# EAGLE design ESP32-S3 Round SPI TFT with Touch 1.28“ GC9A01 v1.1 (EAGLE 6.1)
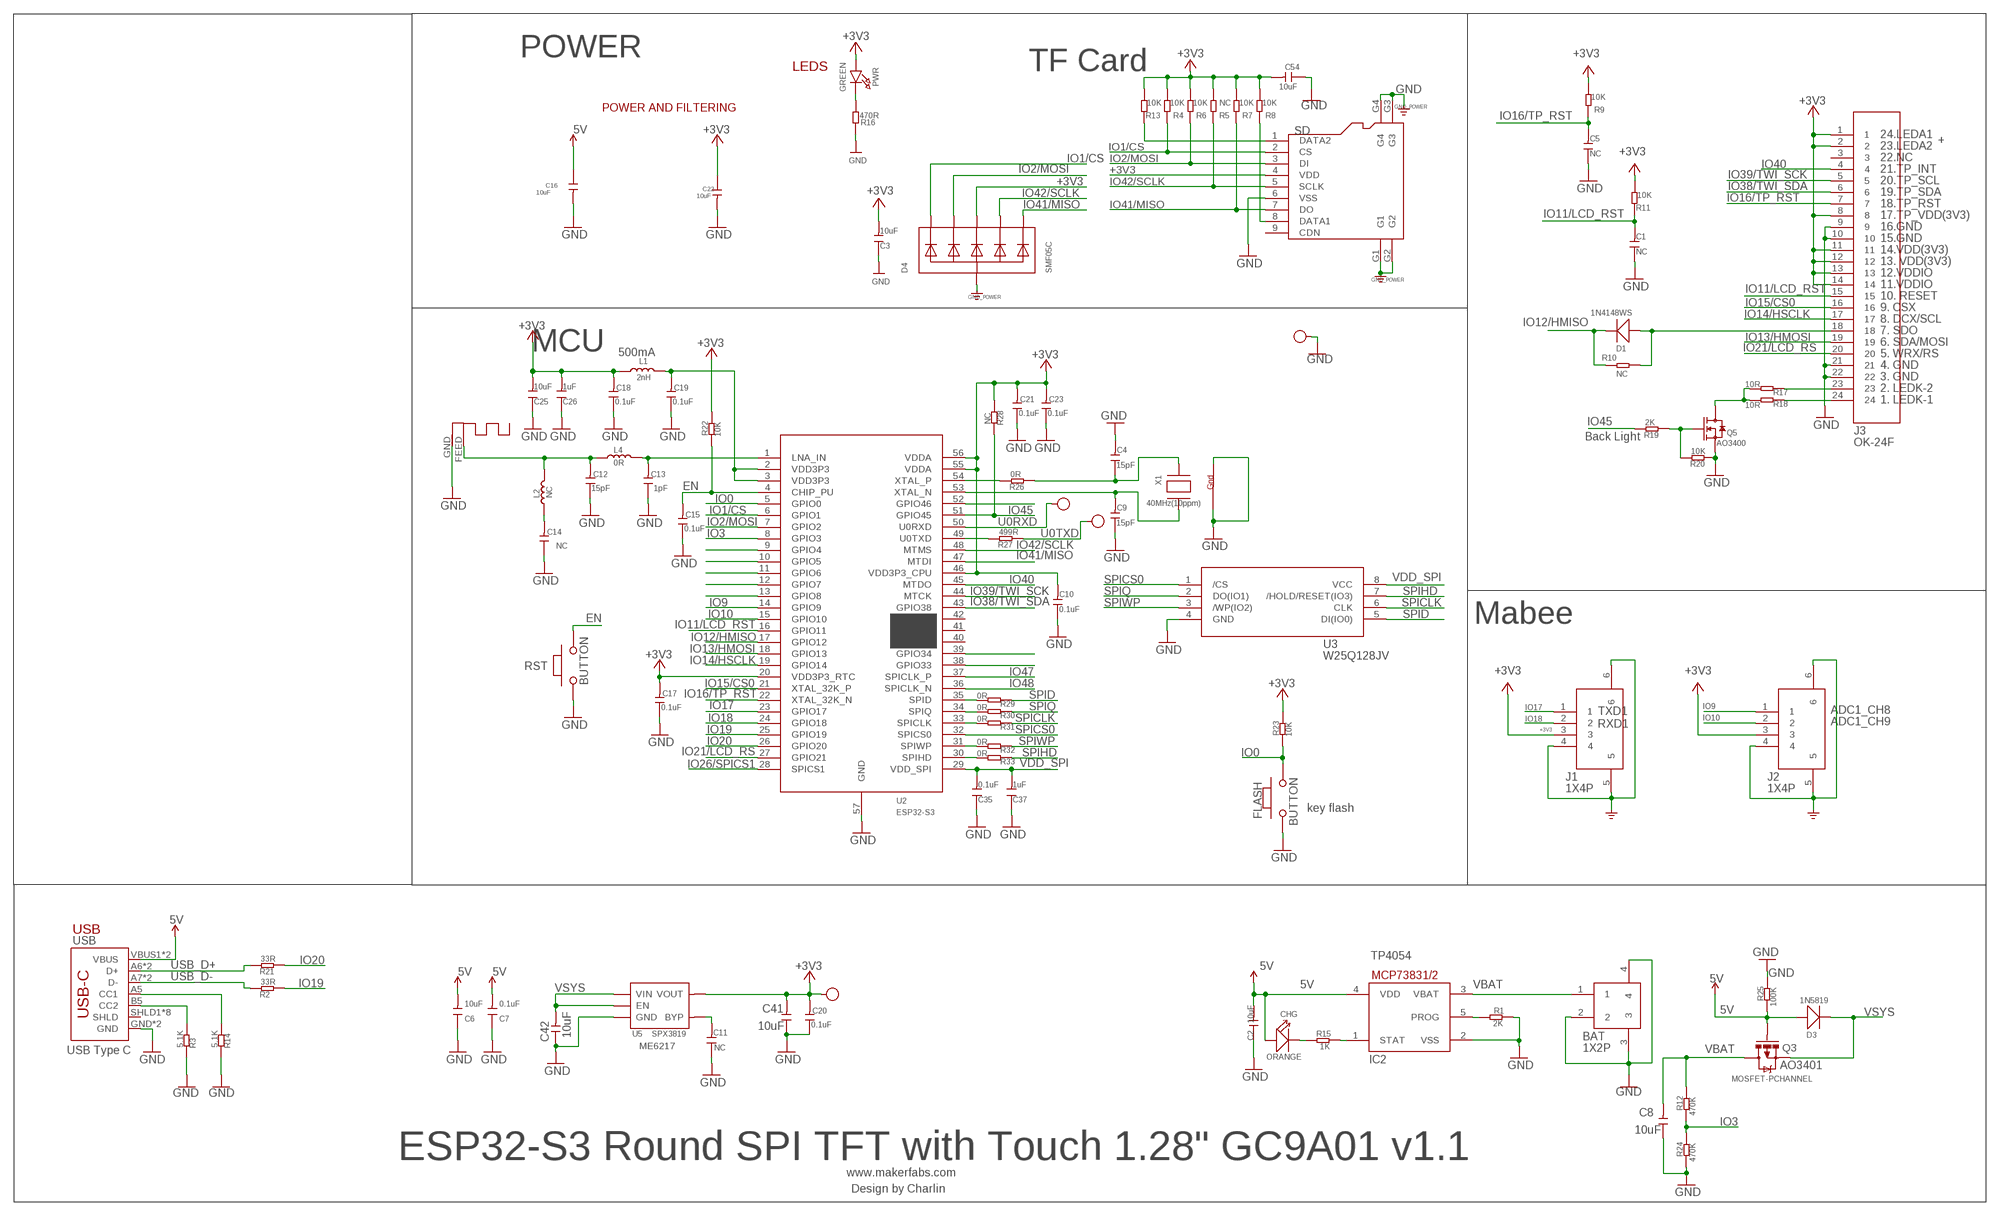
[diagram p0: schematic, sheet 1]

## Parts
3V3  TEST-POINT'4545'  [TP-D45MIL]
ANT1  ANTENNA  [RN-ANT]
BAT  1X2P  [1X2P-SMT1.25MM]
C1  NC  DISCRETE_C-0402  [DISCRETE_C0402]
C2  10uF  C-0603  [C0603]
C3  10uF  DISCRETE_C-0603  [DISCRETE_C0603]
C4  15pF  DISCRETE_C-0402  [DISCRETE_C0402]
C5  NC  DISCRETE_C-0402  [DISCRETE_C0402]
C6  10uF  DISCRETE_C-0603  [DISCRETE_C0603]
C7  0.1uF  DISCRETE_C-0603  [DISCRETE_C0603]
C8  10uF  C-0603  [C0603]
C9  15pF  DISCRETE_C-0402  [DISCRETE_C0402]
C10  0.1uF  DISCRETE_C-0402  [DISCRETE_C0402]
C11  NC  DISCRETE_C-0402  [DISCRETE_C0402]
C12  15pF  DISCRETE_C-0402  [DISCRETE_C0402]
C13  1pF  DISCRETE_C-0402  [DISCRETE_C0402]
C14  NC  DISCRETE_C-0402  [DISCRETE_C0402]
C15  0.1uF  DISCRETE_C-0402  [DISCRETE_C0402]
C16  10uF  C-0603  [C0603]
C17  0.1uF  DISCRETE_C-0402  [DISCRETE_C0402]
C18  0.1uF  DISCRETE_C-0402  [DISCRETE_C0402]
C19  0.1uF  DISCRETE_C-0402  [DISCRETE_C0402]
C20  0.1uF  DISCRETE_C-0402  [DISCRETE_C0402]
C21  0.1uF  DISCRETE_C-0402  [DISCRETE_C0402]
C22  10uF  C-0603  [C0603]
C23  0.1uF  DISCRETE_C-0402  [DISCRETE_C0402]
C25  10uF  DISCRETE_C-0603  [DISCRETE_C0603]
C26  1uF  DISCRETE_C-0603  [DISCRETE_C0603]
C35  0.1uF  DISCRETE_C-0603  [DISCRETE_C0603]
C37  1uF  DISCRETE_C-0603  [DISCRETE_C0603]
C41  10uF  C-0603  [C0603]
C42  10uF  C-0603  [C0603]
C54  10uF  DISCRETE_C-0603  [DISCRETE_C0603]
CHG  ORANGE  007-LED0603  [D0603]
D1  1N4148WS  D'0805'  [SOD323]
D3  1N5819  D'0805'  [SOD323]
D4  SMF05C  TVSARRAY_5LANE  [SOT363]
FLASH  BUTTON  PB157  [157SW]
GND  TEST-POINT'4545'  [TP-D45MIL]
IC2  MCP73831/OT  [SOT23-5L]
J1  1X4P  [1X4P-SMT1.25MM]
J2  1X4P  [1X4P-SMT1.25MM]
J3  OK-24F  [OK-24F-0.4]
L1  2nH  DISCRETE_L0603  [DISCRETE_L0603]
L2  NC  DISCRETE_L0402  [DISCRETE_L0402]
L4  0R  DISCRETE_L0402  [DISCRETE_L0402]
PWR  GREEN  LED0805_NOOUTLINE  [CHIPLED_0805_NOOUTLINE]
Q3  MOSFET-PCHANNEL  [SOT23-3]
Q5  AO3400  MOSFET-N'SOT23'  [SOT23@1]
R1  2K  DISCRETE_R-0402  [DISCRETE_R0402]
R2  33R  DISCRETE_R-0402  [DISCRETE_R0402]
R3  5.1K  DISCRETE_R-0402  [DISCRETE_R0402]
R4  10K  DISCRETE_R-0402  [DISCRETE_R0402]
R5  NC  DISCRETE_R-0402  [DISCRETE_R0402]
R6  10K  DISCRETE_R-0402  [DISCRETE_R0402]
R7  10K  DISCRETE_R-0402  [DISCRETE_R0402]
R8  10K  DISCRETE_R-0402  [DISCRETE_R0402]
R9  10K  DISCRETE_R-0402  [DISCRETE_R0402]
R10  NC  R-0603  [R0603]
R11  10K  DISCRETE_R-0402  [DISCRETE_R0402]
R12  470K  DISCRETE_R-0402  [DISCRETE_R0402]
R13  10K  DISCRETE_R-0402  [DISCRETE_R0402]
R14  5.1K  DISCRETE_R-0402  [DISCRETE_R0402]
R15  1K  DISCRETE_R-0402  [DISCRETE_R0402]
R16  470R  DISCRETE_R-0402  [DISCRETE_R0402]
R17  10R  DISCRETE_R-0402  [DISCRETE_R0402]
R18  10R  DISCRETE_R-0402  [DISCRETE_R0402]
R19  2K  DISCRETE_R-0402  [DISCRETE_R0402]
R20  10K  DISCRETE_R-0402  [DISCRETE_R0402]
R21  33R  DISCRETE_R-0402  [DISCRETE_R0402]
R22  10K  DISCRETE_R-0402  [DISCRETE_R0402]
R23  10K  DISCRETE_R-0402  [DISCRETE_R0402]
R24  470K  DISCRETE_R-0402  [DISCRETE_R0402]
R25  100K  DISCRETE_R-0402  [DISCRETE_R0402]
R26  0R  DISCRETE_R-0402  [DISCRETE_R0402]
R27  499R  DISCRETE_R-0402  [DISCRETE_R0402]
R28  NC  DISCRETE_R-0402  [DISCRETE_R0402]
R29  0R  DISCRETE_R-0402  [DISCRETE_R0402]
R30  0R  DISCRETE_R-0402  [DISCRETE_R0402]
R31  0R  DISCRETE_R-0402  [DISCRETE_R0402]
R32  0R  DISCRETE_R-0402  [DISCRETE_R0402]
R33  0R  DISCRETE_R-0402  [DISCRETE_R0402]
RST  BUTTON  PB157  [157SW]
RX  TEST-POINT'4545'  [TP-D45MIL]
SD  HOLDER-MICROSD-9P  [9P-SMD-W/-RING]
TX  TEST-POINT'4545'  [TP-D45MIL]
U2  ESP32-S3  [QFN56-7*7MM]
U3  W25Q128JV  [SOIC-8-208MIL]
U5  SPX3819  [SOT23-5]
USB  USB_C5  [USB-C-16P-5]
X1  40MHz(10ppm)  XTAL-4-3225  [NX3225]

## Nets
5V: C2.2 C6.2 C7.2 C16.1 CHG.+ D3.+ IC2.4(VDD) Q3.1(G) R25.1 USB.VBUS1(VBUS) USB.VBUS2(VBUS)
+3V3: 3V3.T C3.2 C10.2 C17.2 C18.2 C20.2 C21.2 C22.1 C23.2 C25.2 C26.2 C41.2 C54.2 D4.4(C3) J1.3 J2.3 J3.1 J3.2 J3.8 J3.11 J3.12 J3.13 J3.14 L1.1 PWR.A R4.2 R5.2 R6.2 R7.2 R8.2 R9.2 R11.2 R13.2 R22.2 R23.2 R28.1 SD.4(VDD) U2.20(VDD3P3_RTC) U2.46(VDD3P3_CPU) U2.55(VDDA) U2.56(VDDA) U5.5(VOUT)
EN: C15.2 R22.1 RST.2 U2.4(CHIP_PU)
GND: ANT1.GND BAT.2 BAT.3 BAT.4 C1.1 C2.1 C3.1 C4.2 C5.1 C6.1 C7.1 C8.1 C9.1 C10.1 C11.1 C12.1 C13.1 C14.1 C15.1 C16.2 C17.1 C18.1 C19.1 C20.1 C21.1 C22.2 C23.1 C25.1 C26.1 C35.1 C37.1 C41.1 C42.1 C54.1 D4.2(A) FLASH.1 GND.T IC2.2(VSS) J1.4 J1.5 J1.6 J2.4 J2.5 J2.6 J3.9 J3.10 J3.21 J3.22 Q5.2(S) R1.2 R3.2 R14.2 R16.1 R20.1 R24.1 R25.2 RST.1 SD.6(VSS) SD.G1 SD.G2 SD.G3 SD.G4 U2.57(GND) U3.4(GND) U5.2(GND) USB.GND USB.GND2(GND) X1.2(G2) X1.4(G1) ; supply symbol labelled GND_POWER
IO0: FLASH.2 R23.1 U2.5(GPIO0)
IO1/CS: D4.1(C1) R4.1 SD.2(CS) U2.6(GPIO1)
IO2/MOSI: D4.3(C2) R6.1 SD.3(DI) U2.7(GPIO2)
IO3: R12.1 R24.2 U2.8(GPIO3)
IO9: J2.1 U2.14(GPIO9)
IO10: J2.2 U2.15(GPIO10)
IO11/LCD_RST: C1.2 J3.15 R11.1 U2.16(GPIO11)
IO12/HMISO: D1.- R10.1 U2.17(GPIO12)
IO13/HMOSI: J3.19 U2.18(GPIO13)
IO14/HSCLK: J3.17 U2.19(GPIO14)
IO15/CS0: J3.16 U2.21(XTAL_32K_P)
IO16/TP_RST: C5.2 J3.7 R9.1 U2.22(XTAL_32K_N)
IO17: J1.1 U2.23(GPIO17)
IO18: J1.2 U2.24(GPIO18)
IO19: R2.1 U2.25(GPIO19)
IO20: R21.1 U2.26(GPIO20)
IO21/LCD_RS: J3.20 U2.27(GPIO21)
IO26/SPICS1: U2.28(SPICS1)
IO38/TWI_SDA: J3.6 U2.43(GPIO38)
IO39/TWI_SCK: J3.5 U2.44(MTCK)
IO40: J3.4 U2.45(MTDO)
IO41/MISO: D4.6(C5) R7.1 SD.7(DO) U2.47(MTDI)
IO42/SCLK: D4.5(C4) R5.1 SD.5(SCLK) U2.48(MTMS)
IO45: R19.2 R28.2 U2.51(GPIO45)
IO47: U2.37(SPICLK_P)
IO48: U2.36(SPICLK_N)
N$1: D1.+ J3.18 R10.2
N$2: IC2.5(PROG) R1.1
N$6: R14.1 USB.A5(CC1)
N$7: PWR.C R16.2
N$14: R3.1 USB.B5(CC2)
N$20: Q5.1(G) R19.1 R20.2
N$21: J3.23 R17.1
N$22: Q5.3(D) R17.2 R18.2
N$25: CHG.- R15.1
N$26: IC2.1(STAT) R15.2
N$30: ANT1.FEED C12.2 L2.2 L4.1
N$31: C13.2 L4.2 U2.1(LNA_IN)
N$32: R29.2 U2.35(SPID)
N$33: C19.2 L1.2 U2.2(VDD3P3) U2.3(VDD3P3)
N$34: C14.2 L2.1
N$35: R30.2 U2.34(SPIQ)
N$37: R26.2 U2.54(XTAL_P)
N$38: R31.2 U2.33(SPICLK)
N$40: R32.2 U2.31(SPIWP)
N$41: R33.2 U2.30(SPIHD)
N$45: U2.9(GPIO4)
N$46: U2.10(GPIO5)
N$47: R13.1 SD.1(DATA2)
N$48: R8.1 SD.8(DATA1)
N$49: U2.11(GPIO6)
N$50: U2.12(GPIO7)
N$51: U2.13(GPIO8)
N$63: R27.2 U2.49(U0TXD)
N$64: U2.52(GPIO46)
N$65: C9.2 U2.53(XTAL_N) X1.3(X2)
N$66: C4.1 R26.1 X1.1(X1)
N$67: J3.24 R18.1
N$73: U2.39(GPIO34)
N$74: U2.38(GPIO33)
N$76: C11.2 U5.4(BYP)
SPICLK: R31.1 U3.6(CLK)
SPICS0: U2.32(SPICS0) U3.1(/CS)
SPID: R29.1 U3.5(DI(IO0))
SPIHD: R33.1 U3.7(/HOLD/RESET(IO3))
SPIQ: R30.1 U3.2(DO(IO1))
SPIWP: R32.1 U3.3(/WP(IO2))
U0RXD: RX.T U2.50(U0RXD)
U0TXD: R27.1 TX.T
USB_D+: R21.2 USB.A6(D+) USB.B6(D+)
USB_D-: R2.2 USB.A7(D-) USB.B7(D-)
VBAT: BAT.1 C8.2 IC2.3(VBAT) Q3.3(D) R12.2
VDD_SPI: C35.2 C37.2 U2.29(VDD_SPI) U3.8(VCC)
VSYS: C42.2 D3.- Q3.2(S) U5.1(VIN) U5.3(EN)
Unconnected: J3.3 SD.9(CDN) U2.40(GPIO35) U2.41(GPIO36) U2.42(GPIO37) USB.SHLD1(SHLD) USB.SHLD2(SHLD) USB.SHLD3(SHLD) USB.SHLD4(SHLD) USB.SHLD5(SHLD) USB.SHLD6(SHLD) USB.SHLD7(SHLD) USB.SHLD8(SHLD)

## Notes on the sheet
- POWER
- LEDS | TF Card
- POWER AND FILTERING
- 24.LEDA1
- +
- 23.LEDA2
- 22.NC
- 21.TP_INT
- 20.TP_SCL
- 19.TP_SDA
- 18.TP_RST
- 17.TP_VDD(3V3)
- 16.GND
- 15.GND
- 14.VDD(3V3)
- 13. VDD(3V3)
- 12.VDDIO
- 11.VDDIO
- 10. RESET
- 9. CSX
- 8. DCX/SCL
- 7. SDO
- 6. SDA/MOSI
- MCU
- 500mA | 5. WRX/RS
- 4. GND
- 3. GND
- 2. LEDK-2
- 1. LEDK-1
- Back Light
- Mabee
- TXD1 | ADC1_CH8
- RXD1 | ADC1_CH9
- key flash
- USB
- TP4054
- ME6217
- USB Type C
- AO3401
- ESP32-S3 Round SPI TFT with Touch 1.28" GC9A01 v1.1
- www.makerfabs.com
- Design by Charlin

## Library data of the parts
3V3 GND RX TX = Discrete-new:TEST-POINT; PARTNO: DNP
ANT1 = adafruit:ANTENNA
BAT = sale:1X2P
C1 C3-C7 C9-C15 C17-C21 C23 C25 C26 C35 C37 C54 = A9G:DISCRETE_C*: Ceramic Capacitors
C2 C8 C16 C22 C41 C42 = Discrete:C*: Ceramic Capacitors
CHG = Discrete:007-LED*
D1 D3 = Discrete:D*
D4 = microbuilder:TVSARRAY_5LANE: Voltage Transient Suppressor Array SOT363 SMF05C - 100W 5V: Digikey - SMF05CT1GOSCT-ND
FLASH RST = MySMD:PB157
IC2 = adafruit:MCP73831: MCP73831/2 Miniature Single-Cell, Fully Integrated Li-Ion, Li-Polymer Charge Management Controllers. Nice and small simple lipoly charge controller, with adjustable current and status output (LED) http://www.ladyada.net/library/pcb/eaglelibrary.html
J1 J2 = sale:1X4P
J3 = sale:OK-24F
L1 L2 L4 = A9G:DISCRETE_L*
PWR = microbuilder:LED: LED 0603 - 0603 Surface Mount Package 2mA: Green LED - Low Power (3.9mcd, 2ma, 1.7Vf) - Digikey: 475-2709-2-ND Orange LED - Low Power (9.8mcd, 2ma, 1.8Vf) - Digikey: 475-1194-2-ND Red LED - Low Power (5mcd, 2ma, 1.8Vf) - Digikey: 475-1195-2-ND Yellow LED - Low Power (7mcd, 2ma, 1.8Vf) - Digikey: 475-1196-2-ND 5mA: Blue LED - Low Power (17mcd, 5ma, 2.9Vf) - Digikey: LNJ937W8CRACT-ND 0805 - 0805 Surface Mount Package 2mA: Red LED (8.8mcd, 2mA, 1.8Vf, Clear) - Low Power [Digikey: 475-2510-1-ND] Green LED (5mcd, 2mA, 1.8Vf, Clear) - Low Power [Digikey: 475-2730-1-ND] Yellow LED (11.3mcd, 2mA, 1.8Vf, Clear) - Low Power [Digikey: 475-2555-1-ND] 20mA: Red LED (104mcd, 20mA, Diffused) - LS R976 [Digikey: 475-1278-6-ND] Red LED (12mcd, 20mA, 2.0Vf, Clear) - APT2012EC [Digikey: 754-1128-1-ND] Green LED (15mcd, 20mA, 2.2Vf, Clear) - APT2012GC [Digikey: 754-1131-1-ND] Orange LED (160mcd, 20mA, 2.1Vf, Clear) - APT2012SECK [Digikey: 754-1130-1-ND] 1206 - 1206 Surface Mount Package Green LED (26mcd, 20mA, Diffused) - LG N971 [Digikey: 475-1407-6-ND] Red LED (15mcd, 20mA, Diffused) - LH N974 [Digikey: 475-1416-6-ND] Cree - Cree High-Power Surface Mount LEDs XPEBWT-L1-0000-00D50 - White 111lm 350mA 2.9Vf 6200K 110° XTEAWT-00-0000-00000LEE3 - White 114lm 350mA 2.85Vf 5000K 115° Everlight - Everlight 45-21 Series Surface Mount LEDs 45-21/QK2C-B2832AC2CB2/2T - Warm White 2000mcd 20mA 3.25Vf 3050K 120° 45-21/LK2C-B38452C4CB2/2T - Nuetral White 2000mcd 20mA 3.25Vf 4150K 120° 45-21/LK2C-B50634C6CB2/2T - Cold White 2200mcd 20mA 3.25Vf 5650K 120° PLCC2 Reverse Mount LS T77K-J1L2-1-0-2-R18-Z - Red 11.25mcd 2mA 1.8Vf 630nm 120° LO T77K-L1M2-24-Z - Orange 19.6mcd 2mA 1.8Vf 606nm 120° LY T77K-K2M1-26-Z - Yellow 15.7mcd 2mA 1.8Vf 587nm 120°
Q3 = User-Submitted:MOSFET-PCHANNEL: Generic PMOSFET IRLML2244 - TRANS-11153 (SOT-23 -20V -4.3A) (1.Gate 2.Source 3.Drain) FQP27P06 - COM-10349 <http://www.sparkfun.com/products/10349> (TO-220 -60V -27A) (1.Gate 2.Source 3.Drain); PROD_ID: TRANS-08285
Q5 = Discrete:MOSFET-N: IRLL014: http://www.vishay.com/docs/91319/sihll014.pdf
R1-R9 R11-R33 = A9G:DISCRETE_R*
R10 = Discrete:R*
SD = Connector:HOLDER-MICROSD-9P
U2 = sale:ESP32-S3
U3 = self:W25Q128JV
U5 = IC:SPX3819
USB = USBC:USB_C: USB Type C 16Pin Connector Super Speed pins not available on the 16-pin purely SMD connector so this part is best for USB 2.0 implementations. D1 and D2 are tied together enabling D+/- no matter which way the cable is plugged into the connector. The two channel configuration pins (CC1/2) are exposed. These are normally connected to ground via 5.1k resistors but can be reconfigured for high current/high power applications.
X1 = adafruit:XTAL-4: Classic 4-pin 3.2 x 2.5mm crystal

## Net classes
0 default: width 0.152 mm, drill 0.305 mm, clearance 0.152 mm
1 vbat: width 0.254 mm, drill 0.305 mm, clearance 0.152 mm

## Board
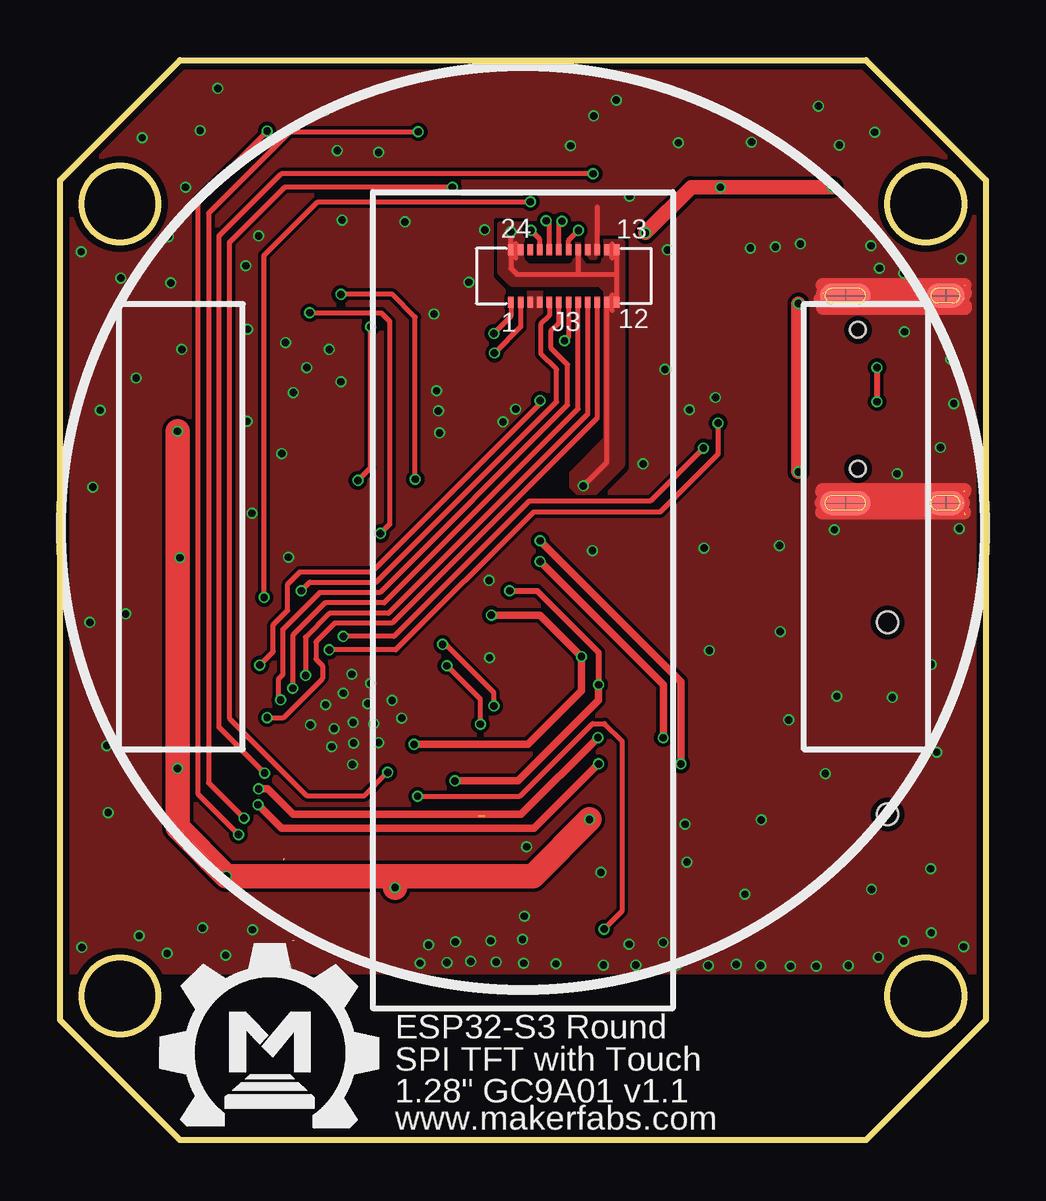
[diagram p1: board, top side]
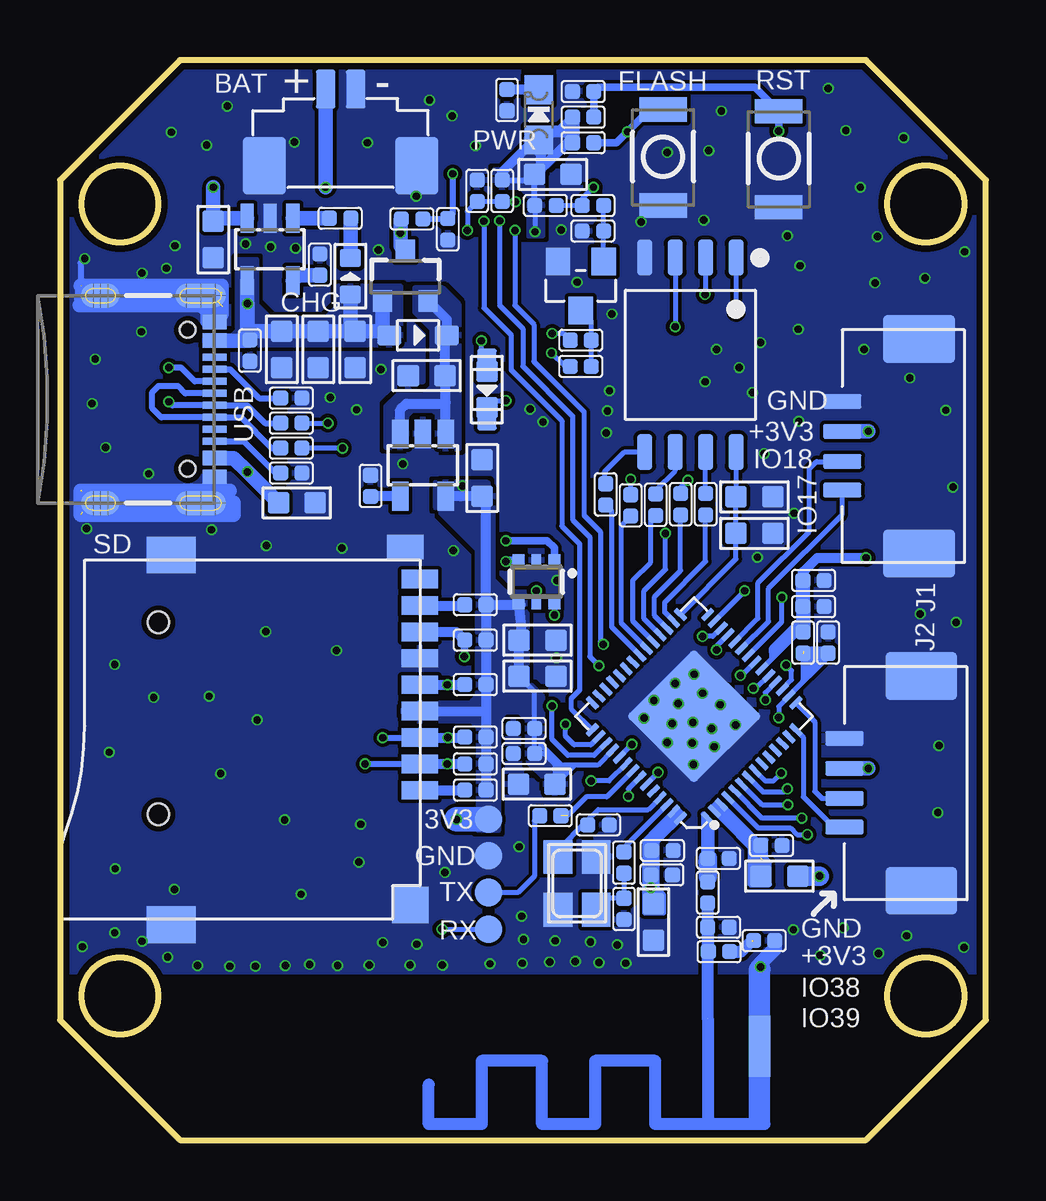
[diagram p2: board, bottom side, seen from below]

Size 38.6 x 45 mm. Coordinates in mm from the lower left corner, seen from the top.
Outline: 0,5 0,40 5,45 33.6,45 38.6,40 38.6,5 33.6,0 5,0 0,5
Outline: circle at 2.5,39 radius 1.6
Outline: circle at 2.5,6 radius 1.6
Outline: circle at 36.1,6 radius 1.6
Outline: circle at 36.1,39 radius 1.6
Copper layers (1*16): Top 0.035mm / dielectric 1.5mm / Bottom 0.035mm
Design rules: minimum track width 6mil, minimum drill 10mil, track to track 6mil, track to pad 6mil, pad to pad 6mil, via to via 6mil, smd to smd 0mil, copper to edge 10mil, drill to drill 10mil, minimum pad ring 3mil, minimum via ring 3mil, stop-mask expansion 2mil, vias tented up to drill 100mil, thermal gap 0mil
tRestrict: area -0.2,-0.1 to 38.8,6.9
bRestrict: area -0.2,-0.1 to 38.8,6.9

### Footprints (pad centres in the part's own frame; a part is rotated, then mirrored left to right if it is on the bottom)
TP-D45MIL = smd 1.143 x 1.143: T 0,0
RN-ANT = smd 0.025 x 0.025: FEED 0,2.159 | smd 2.54 x 0.889: GND -1.143,0
1X2P-SMT1.25MM = smd 0.8 x 1.6: 1 -0.625,0; 2 0.625,0 | smd 1.8 x 2.4: 3 3.175,-3.2; 4 -3.175,-3.2
DISCRETE_C0402 = smd 0.635 x 0.635: 1 -0.445,0; 2 0.445,0
C0603 = smd 0.889 x 0.889: 1 -0.762,0; 2 0.762,0
DISCRETE_C0603 = smd 0.889 x 0.889: 1 -0.762,0; 2 0.762,0
D0603 = smd 0.762 x 0.889: + -0.762,0; - 0.762,0
SOD323 = smd 1 x 0.8: + -1.2,0; - 1.2,0
SOT363 = smd 0.5 x 0.5: 1 -0.75,-0.9; 3 0.75,-0.9; 4 0.75,0.9; 6 -0.75,0.9 | smd 0.4 x 0.5: 2 0,-0.9; 5 0,0.9
157SW = smd 1.016 x 1.981: 1 0,0; 2 4,0
SOT23-5L = smd 0.55 x 1.2: 1 -0.95,-1.3; 2 0,-1.3; 3 0.95,-1.3; 4 0.95,1.3; 5 -0.95,1.3
1X4P-SMT1.25MM = smd 0.6 x 1.6: 1 -1.825,2.54; 2 -0.625,2.54; 3 0.625,2.54; 4 1.875,2.54 | smd 2 x 3: 5 4.475,-0.66; 6 -4.475,-0.66
OK-24F-0.4 = smd 0.23 x 0.47: 1 -2.2,1.095; 2 -1.8,1.095; 3 -1.4,1.095; 4 -1,1.095; 5 -0.6,1.095; 6 -0.2,1.095; 7 0.2,1.095; 8 0.6,1.095; 9 1,1.095; 10 1.4,1.095; 11 1.8,1.095; 12 2.2,1.095; 13 2.2,-1.095; 14 1.8,-1.095; 15 1.4,-1.095; 16 1,-1.095; 17 0.6,-1.095; 18 0.2,-1.095; 19 -0.2,-1.095; 20 -0.6,-1.095; 21 -1,-1.095; 22 -1.4,-1.095; 23 -1.8,-1.095; 24 -2.2,-1.095
DISCRETE_L0603 = smd 0.889 x 0.889: 1 -0.762,0; 2 0.762,0
DISCRETE_L0402 = smd 0.635 x 0.635: 1 -0.445,0; 2 0.445,0
CHIPLED_0805_NOOUTLINE = smd 1.2 x 1.2: A 0,-1.05; C 0,1.05
SOT23-3 = smd 0.8 x 0.9: 1 -0.95,-1; 2 0.95,-1; 3 0,1.1
SOT23@1 = smd 1.016 x 1.143: 1 -0.95,-1.016; 2 0.95,-1.016; 3 0,1.016
DISCRETE_R0402 = smd 0.635 x 0.635: 1 -0.445,0; 2 0.445,0
R0603 = smd 0.889 x 0.889: 1 -0.762,0; 2 0.762,0
9P-SMD-W/-RING = smd 1.524 x 0.762: 1 0,4.4; 2 0,3.3; 3 0,2.2; 4 0,1.1; 5 0,0; 6 0,-1.1; 7 0,-2.2; 8 0,-3.3; 9 0,-4.4 | smd 1.524 x 1.016: G1 0.6,-5.746 | smd 2.032 x 1.524: G2 10.373,-5.4; G3 10.373,10 | smd 1.524 x 1.524: G4 0.392,9.181 | hole 0.889: 10.9,-2.6; 10.9,5.4
QFN56-7*7MM = smd 0.6 x 0.2: 1 -3.4,2.6; 2 -3.4,2.2; 3 -3.4,1.8; 4 -3.4,1.4; 5 -3.4,1; 6 -3.4,0.6; 7 -3.4,0.2; 8 -3.4,-0.2; 9 -3.4,-0.6; 10 -3.4,-1; 11 -3.4,-1.4; 12 -3.4,-1.8; 13 -3.4,-2.2; 14 -3.4,-2.6; 29 3.4,-2.6; 30 3.4,-2.2; 31 3.4,-1.8; 32 3.4,-1.4; 33 3.4,-1; 34 3.4,-0.6; 35 3.4,-0.2; 36 3.4,0.2; 37 3.4,0.6; 38 3.4,1; 39 3.4,1.4; 40 3.4,1.8; 41 3.4,2.2; 42 3.4,2.6 | smd 0.2 x 0.6: 15 -2.6,-3.4; 16 -2.2,-3.4; 17 -1.8,-3.4; 18 -1.4,-3.4; 19 -1,-3.4; 20 -0.6,-3.4; 21 -0.2,-3.4; 22 0.2,-3.4; 23 0.6,-3.4; 24 1,-3.4; 25 1.4,-3.4; 26 1.8,-3.4; 27 2.2,-3.4; 28 2.6,-3.4; 43 2.6,3.4; 44 2.2,3.4; 45 1.8,3.4; 46 1.4,3.4; 47 1,3.4; 48 0.6,3.4; 49 0.2,3.4; 50 -0.2,3.4; 51 -0.6,3.4; 52 -1,3.4; 53 -1.4,3.4; 54 -1.8,3.4; 55 -2.2,3.4; 56 -2.6,3.4 | smd 4 x 4: 57 0,0
SOIC-8-208MIL = smd 1.5 x 0.635: 1 -4.05,1.905; 2 -4.05,0.635; 3 -4.05,-0.635; 4 -4.05,-1.905; 5 4.05,-1.905; 6 4.05,-0.635; 7 4.05,0.635; 8 4.05,1.905
SOT23-5 = smd 0.69 x 1.2: 1 -0.95,-1.3; 2 0,-1.3; 3 0.95,-1.3; 4 0.95,1.3; 5 -0.95,1.3
USB-C-16P-5 = smd 0.3 x 1: A5 -1.25,-0.34; A6 -0.25,-0.34; A7 0.25,-0.34; A8 1.25,-0.34; B5 1.75,-0.34; B6 0.75,-0.34; B7 -0.75,-0.34; B8 -1.75,-0.34 | smd 0.6 x 1: GND -3.225,-0.34; GND2 3.225,-0.34; VBUS1 -2.45,-0.34; VBUS2 2.45,-0.34 | smd 1 x 2.1: SHLD1 -4.32,-0.915; SHLD2 4.32,-0.915 | smd 1 x 2.1 bottom: SHLD3 -4.32,-0.915; SHLD4 4.32,-0.915 | smd 1 x 1.6: SHLD5 -4.32,-5.095; SHLD8 4.32,-5.095 | smd 1 x 1.6 bottom: SHLD6 -4.32,-5.095; SHLD7 4.32,-5.095 | hole 0.65: -2.89,-1.445; 2.89,-1.445
NX3225 = smd 1.4 x 1.2: 1 -1.1,-0.8; 2 1.1,-0.8; 3 1.1,0.8; 4 -1.1,0.8

### Placement (x,y rotation side)
3V3  20.73,13.36 0 bottom
ANT1  9.44,5.05 90 bottom
BAT  26.9,43.79 0 bottom
C1  6.58,20.73 270 bottom
C2  26.29,32.94 90 bottom
C3  18.69,19.33 180 bottom
C4  15.09,9.63 270 bottom
C5  21.21,39.55 270 bottom
C6  27.84,32.94 90 bottom
C7  28.73,26.54 180 bottom
C8  32.21,37.52 90 bottom
C9  16.15,13.13 180 bottom
C10  7.19,22.23 180 bottom
C11  25.65,27.25 270 bottom
C12  11.15,8.86 180 bottom
C13  11.15,11.73 180 bottom
C14  9.25,8.31 180 bottom
C15  16.79,43.69 0 bottom
C16  29.36,32.94 270 bottom
C17  13.51,11.05 180 bottom
C18  13.49,12.06 180 bottom
C19  8.94,12.27 180 bottom
C20  7.19,23.32 180 bottom
C21  19.25,17.14 0 bottom
C22  13.86,9.08 270 bottom
C23  19.25,16.1 0 bottom
C25  18.06,40.23 180 bottom
C26  21.01,27.58 270 bottom
C35  9.65,25.27 180 bottom
C37  9.65,26.8 180 bottom
C41  18.69,20.83 180 bottom
C42  23.32,31.85 0 bottom
C54  18.72,14.83 0 bottom
CHG  26.49,35.99 90 bottom
D1  20.8,31.27 270 bottom
D3  23.67,33.53 0 bottom
D4  18.75,23.26 180 bottom
FLASH  13.46,38.94 90 bottom
GND  20.73,11.84 0 bottom
IC2  29.84,37.11 180 bottom
J1  3.45,28.91 90 bottom
J2  3.35,14.86 90 bottom
J3  21,36 0 top
L1  8.61,11 180 bottom
L2  11.13,7.85 180 bottom
L4  11.6,10.31 90 bottom
PWR  18.64,42.71 0 bottom
Q3  24.21,35.97 0 bottom
Q5  16.89,35.59 180 bottom
R1  27.76,36.47 90 bottom
R2  28.96,29.87 180 bottom
R3  28.96,27.79 0 bottom
R4  21.29,15.67 0 bottom
R5  21.29,18.97 0 bottom
R6  21.29,16.79 0 bottom
R7  21.29,20.83 0 bottom
R8  21.29,22.3 0 bottom
R9  20.17,39.55 90 bottom
R10  20.8,31.27 90 bottom
R11  7.62,20.73 90 bottom
R12  23.93,38.38 180 bottom
R13  21.29,14.58 0 bottom
R14  28.96,30.91 0 bottom
R15  26.92,38.4 180 bottom
R16  19.96,43.33 90 bottom
R17  16.89,32.23 0 bottom
R18  16.89,33.32 0 bottom
R19  16.38,38.94 180 bottom
R20  16.38,37.87 0 bottom
R21  28.96,28.83 180 bottom
R22  16.79,42.62 180 bottom
R23  16.79,41.55 180 bottom
R24  22.43,37.95 90 bottom
R25  30.68,32.89 270 bottom
R26  15.09,11.56 90 bottom
R27  18.16,13.51 0 bottom
R28  18.36,38.94 0 bottom
R29  15.85,26.9 270 bottom
R30  14.81,26.44 270 bottom
R31  13.77,26.47 270 bottom
R32  12.73,26.49 270 bottom
R33  11.68,26.49 270 bottom
RST  8.64,38.87 90 bottom
RX  20.73,8.79 0 bottom
SD  23.6,18.97 180 bottom
TX  20.73,10.31 0 bottom
U2  12.17,17.65 135 bottom
U3  12.32,32.72 270 bottom
U5  23.47,28.12 180 bottom
U$1  [MAKERFABS_0.3]  4.63,0.57 0 top
USB  31.82,30.86 270 bottom
X1  17.04,10.69 90 bottom

### Tracks (layer width: path | path; a pad name or v marks a point on that pad's centre or on a via)
5V  (via drill 0.3)
  Top 0.61: v30.79,34.85 v30.79,27.84
  Bottom 0.61: USB.VBUS2 31.36,28.41 v30.79,27.84 C7.2 | USB.VBUS1 30.71,33.31 R25.1 | 30.8,33.86 30.8,33.45 R25.1 | 30.8,33.86 30.64,33.7 C16.1 C6.2 C2.2 | C2.2 25.35,33.71 | 25.35,33.71 25.05,33.71 D3.+ | CHG.+ 26.49,33.91 C2.2 | Q3.1 25.16,33.9 25.35,33.71 | v30.79,34.85 30.79,33.44 R25.1 | 30.8,33.86 IC2.4
  pour Bottom: 24.41,33.12 32.56,33.12 32.56,33.5 31.42,33.5 31.19,33.73 31.19,36.6 31.19,36.7 30.4,36.7 30.4,34.8 29.87,34.26 27.51,34.26 27.05,34.72 27.05,35.59 24.61,35.59 24.41,35.59
+3V3  (via drill 0.3)
  Top 0.203: J3.1 18.8,36.32 19.05,36.07 21.57,36.07 | 23.2,36.04 J3.12 J3.11 | 23.2,36.04 J3.13 J3.14 22.8,28.24 v21.82,27.25 | 21.57,36.07 23.18,36.07 23.2,36.04 | J3.8 21.6,36.1 21.57,36.07 | J3.2 J3.1 | J3.1 v18.8,37.85 | 19,36.75 19,37.36 | 23.01,34.57 23.01,35.2 | 23.01,36.75 23.01,37.34
  Top 0.406: v5,24.26 5,24.46 4.9,24.56
  Top 1.016: v4.9,29.53 4.9,24.56 v4.9,15.48 4.9,13.62 | 4.9,13.62 4.9,13.61 | 4.9,13.62 4.9,13.03 v6.93,11 13.97,11 | v13.97,10.52 13.97,11 | 13.97,11 19.71,11 v22.07,13.36
  Bottom 0.203: U2.56 13.93,12.21 C18.2 | C18.2 13.96,12.04 C17.2 13.97,11.04 v13.97,10.52 13.97,9.95 C22.1 | U2.20 7.8,21.17 R11.2 | C18.2 13.93,12.78 U2.55 13.95,12.76 13.95,12.37 | 17.96,15.62 17.96,15.66 18.4,16.1 C23.2 C21.2 18.81,18.68 C3.2 | 17.96,15.62 C54.2 | U2.46 16.18,15.62 17.14,15.62 | 17.3,15.62 17.96,15.62 | 13.95,12.37 13.95,10.52 | v21.82,27.25 21.82,26.92 21.92,26.82 | R28.1 18.8,38.92 v18.8,37.85 | 12.72,13.66 12.6,13.54 13.72,12.42 13.72,10.49 13.44,10.21 13.44,9.45 14.22,9.45 14.22,12.47 12.88,13.82 12.72,13.66 | 12.72,13.66 12.78,13.66 14.07,12.37 13.95,12.37 | 13.95,12.37 12.75,13.56 | 13.95,12.37 14.1,12.22 14.1,10.26 13.69,10.26 13.84,10.41 13.84,12.22 | 17.83,15.14 17.63,15.14 17.14,15.62 | 17.14,15.62 17.3,15.62 | 17.3,15.62 17.73,15.19 17.73,15.65 18.57,16.48
  Bottom 0.254: R28.1 C25.2 19.06,39.99 R9.2 | 7.72,21.49 7.95,21.26 | 7.95,21.26 8.91,20.3 | 8.91,20.3 8.91,20.09 | 8.91,20.3 8.91,20.5 7.77,21.64 | 7.8,21.17 7.86,21.17 7.95,21.26
  Bottom 0.406: 20.84,17.91 R5.2 R7.2 R8.2 | 20.84,17.91 R6.2 R4.2 R13.2 | SD.4 20.88,17.87 20.84,17.91 | C3.2 C41.2 19.34,20.95 D4.4 19.4,22.3 R8.2 | R8.2 20.84,26.66 C26.2 21.92,26.82 U5.5 | C20.2 7.63,23.66 7.04,24.26 v5,24.26 | R22.2 17.78,42.06 18.69,42.06 | 18.69,42.06 18.8,42.06 18.72,41.99 17.3,41.99 17.3,41.71 18.54,40.46 18.54,41.07 18.97,41.5 18.69,41.78 18.69,41.81 | 18.69,42.06 18.69,41.81 | 18.69,41.81 20.19,40.31
  Bottom 0.61: J2.3 v4.9,15.48 | J1.3 v4.9,29.53 | R11.2 7.62,22.21 C10.2 C20.2 | R23.2 R22.2
  Bottom 0.813: L1.1 v6.93,11
  Bottom 1.016: 3V3.T v22.07,13.36
  pour Bottom: 22.94,27.43 20.83,27.43 20.55,27.15 20.55,23.34 20.04,22.83 19.13,22.83 19.13,19.13 18.49,18.49 18.49,16.41 17.53,15.44 17.53,14.43 18.36,14.43 18.36,15.01 19.1,15.75 19.1,17.5 19.43,17.83 20.04,17.83 20.32,17.55 20.32,12.88 21.16,12.88 21.16,17.17 21.44,17.45 24.31,17.45 24.31,18.21 21.49,18.21 21.18,18.52 21.18,24.59 22.94,26.34
  pour Top: 23.44,37.44 23.44,28.12 22.25,26.92 21.64,26.92 21.34,27.23 21.34,27.79 22.76,29.21 22.76,31.67 22.76,35.38 22.5,35.64 18.85,35.64 18.34,36.14 18.34,38.05 18.34,38.18 19.25,38.18 19.25,36.65 19.48,36.42 21.29,36.42 21.46,36.6 21.46,37.31 21.69,37.31 21.69,36.63 21.89,36.42 22.56,36.42 22.68,36.55 22.68,37.44
  pour Bottom: 18.47,37.67 18.47,40.39 17.5,41.35 17.5,41.88 19.2,41.88 19.2,40.89 19.66,40.44 20.5,40.44 20.5,39.7 19.41,39.7 19.08,39.37 19.08,37.69 19.08,37.67
EN  (via drill 0.3)
  Top 0.203: v7.44,12.72 5.77,14.4 5.77,39.17 v8.64,42.04
  Bottom 0.203: U2.4 9.5,13.01 8.15,13.01 7.87,12.72 v7.44,12.72
  Bottom 0.305: v8.64,42.04 RST.2 9.64,43.87 16.17,43.87 C15.2 R22.1
GND  (via drill 0.3)  (10 unrouted)
  Top 0.203: J3.10 22.4,38.88
  Top 0.61: 31.83,35.28 37.72,35.28 | 31.8,35.61 37.69,35.61 | 31.73,35.03 37.62,35.03 | 31.83,34.75 37.72,34.75 | 31.77,27 37.67,27 | 31.75,26.54 37.64,26.54 | 31.77,26.16 37.67,26.16 | 31.8,27.08 37.69,27.08 | 37.72,34.67 31.83,34.67 31.83,34.72 32.69,35.59 32.69,35.61
  Bottom 0.203: USB.GND 32.03,34.09
  Bottom 0.254: v37.57,36.73 37.74,36.55 37.74,35.59
  Bottom 0.61: 31.52,27.05 37.74,27.05 37.74,26.06 31.37,26.06 31.37,26.54 37.69,26.54 | 37.74,35.59 31.85,35.59 31.85,35.33 | 31.85,35.08 31.93,35.08 | 31.93,35.08 37.72,35.08 | 31.88,34.77 37.77,34.77 | 31.85,35.33 37.67,35.33 | 32.03,34.09 32.03,34.49 | 32.03,34.98 31.93,35.08 | 31.85,35.33 31.85,35.08 | 31.85,35.08 31.85,34.4 USB.GND | 32.03,34.98 32.13,34.98 32.44,34.67 32.28,34.67 | 32.03,34.98 32.03,34.49 | 32.03,34.49 32.44,34.09 32.44,34.52 32.59,34.67 | 9.42,7.11 9.42,7.34 8.79,7.98 8.79,8.28 8.81,8.31
  Bottom 0.889: ANT1.GND 9.44,7.1 9.42,7.11
  other vias: 28.19,7.32 29.24,13.34 17.91,20.09 17.88,23.32 30.02,21.18 30.38,17.5 26.85,24.66 26.24,30.43 35.2,33.68 31.62,43.08 25.78,41.55 21.29,41.43 5.84,42.06 2.54,35.92 3.17,31.75 1.37,27.2 2.74,21.92 1.96,16.43 2.01,13.64 6.91,7.7 5.94,8.84 25.15,8.23 31.9,15.27 34.7,18.44 26.06,13.16 28.55,10.24 26.14,11.58 16.13,7.39 9.4,33.22 11.23,32.94 11.71,31.6 4.62,35.71 11.76,38.33 13.28,41.15 11.56,41.22 22.25,42.67 32.49,41.45 33.81,37.26 34.16,36.32 35.18,36.12 37.13,32.54 37.26,30.68 36.7,28.85 34.9,27.76 30,24.77 37.49,25.48 36.32,19.81 36.55,16.15 36.3,11.3 32.38,18.49 23.72,8.15 12.95,19.02 13.84,18.31 14.25,17.58 13.08,17.35 13.28,16.56 12.19,15.65 11.33,16.38 10.44,17.3 11.07,18.14 12.17,19.41 11.81,18.62 12.83,18.19 12.22,17.4 11.43,17.14 12.24,16.54 15.82,29.46 15.77,30.38 14.38,38.25 17.7,37.92 17.04,35.74 15.6,34.42 15.7,31.22 24.31,28.17 7.82,33.78 7.8,29.95 8.28,37.67 10.29,32.18 23.75,39.32 33.96,41.99 23.19,43.33 22.2,24.56 25.22,32.11 27.33,30.94 3.43,41.76 6.58,43.81 5.23,39.7 4.52,37.64 0.89,37.01 1.68,30.4 1.24,21.56 0.91,8.03 3.3,8.51 4.47,7.77 8.03,8.76 36.32,8.64 33.83,10.44 37.67,8.05 27.08,20.4 32.28,25.43 11.02,42.88 19.46,12.22 9.53,24.28 9.25,28.6 5.08,32.94 7.75,36.42 8,26.11 15.01,7.37 18.19,7.42 17.12,7.44 19.33,7.37 20.68,7.34 22.66,7.29 24,7.29 25.7,7.29 27.03,7.26 29.21,7.26 30.45,7.24 31.52,7.24 32.87,7.26 34.11,7.62 35.18,8.28 17.96,8.31 16.48,8.26 15.37,8.13 9.4,7.21 22.56,11.15 19,30.45 18.47,29.92 9.73,31.14 29.82,37.21 28.78,37.16 30.86,37.34 25.32,37.08 28.83,41.58 19.35,9.32 19.28,8.36
  pour Top (rank 6): -10.16,55.88 -10.16,-5 45.72,-5 45.72,55.88
  pour Bottom (rank 6): -12.7,-5 45.72,-5 45.72,55.88 -12.7,55.88
IO0  (via drill 0.3)
  Top 0.203: v7.67,13.41 6.2,14.88 6.2,38.61 9.6,42.01 v14.94,42.01
  Bottom 0.203: U2.5 9.34,13.41 v7.67,13.41
  Bottom 0.305: FLASH.2 14,42.94 v14.94,42.01 15.39,41.55 R23.1
IO1/CS  (via drill 0.3)
  Top 0.305: v20.02,24.97 25.88,19.1 v25.88,15.67 | v22.45,15.67 19.76,12.98 9.25,12.98 v8.26,13.97
  Bottom 0.203: U2.6 9.33,13.97 v8.26,13.97
  Bottom 0.254: v25.88,15.67 SD.2
  Bottom 0.305: v20.02,24.97 18.29,24.97 18,24.68 D4.1
  Bottom 0.406: SD.2 v22.45,15.67 R4.1
IO2/MOSI  (via drill 0.3)
  Top 0.305: v25.15,16.76 25.15,18.97 v20.02,24.11 | v22.43,16.77 19.22,13.56 9.73,13.56 8.66,14.63 v8.28,14.63
  Bottom 0.203: U2.7 9.3,14.5 8.41,14.5 v8.28,14.63
  Bottom 0.254: v25.15,16.76 v25.14,16.77 SD.3
  Bottom 0.305: D4.3 19.96,24.16 v20.02,24.11
  Bottom 0.406: SD.3 v22.43,16.77 21.75,16.77 R6.1
IO3  (via drill 0.3)
  Top 0.203: v8.53,15.29 6.63,17.2 6.63,37.67 9.22,40.26 v22.23,40.26
  Bottom 0.203: U2.8 9.19,14.96 8.87,14.96 v8.53,15.29
  Bottom 0.254: R12.1 22.44,38.38 R24.2 22.23,38.59 v22.23,40.26
IO9
  Bottom 0.203: U2.14 7.62,16.78 7.62,14.3 6.35,13.03 J2.1
IO10
  Bottom 0.203: U2.15 7.14,17.43 7.14,14.53 6.84,14.23 J2.2
IO11/LCD_RST  (via drill 0.3)  (2 unrouted)
  Top 0.203: v8.64,17.6 9.32,17.6 10.95,19.23 10.95,19.76 10.67,20.04 10.67,20.75 11.46,21.54 13.84,21.54 22.4,30.1 J3.15
  Bottom 0.203: R11.1 C1.2 6.58,20.13 U2.16 8.64,18.07 v8.64,17.6
  Bottom 0.254: 7.62,20.37 7.62,19.13 7.42,19.33 7.42,19.99 7.21,19.99 7.21,19.58 7.01,19.79 7.01,20.02
  Bottom 0.61: 6.81,20.27 7.62,20.27
IO12/HMISO  (via drill 0.3)
  Top 0.203: v8.33,19.79 8.89,20.34 8.89,21.46 9.5,22.07 9.5,23.16 10.01,23.67 13.01,23.67 20.02,30.68 v20.02,30.81
  Bottom 0.203: U2.17 8.1,19.17 8.1,19.56 v8.33,19.79 | D1.- R10.1 20.5,30.81 v20.02,30.81
IO13/HMOSI  (via drill 0.3)
  Top 0.203: J3.19 20.8,34.06 20.47,33.73 20.47,32.99 21.16,32.31 21.16,30.63 13.34,22.81 10.82,22.81 9.3,21.29 9.3,19.41 9.12,19.23 9.12,18.41 v9.2,18.34
  Bottom 0.203: U2.18 9.2,18.64 v9.2,18.34
IO14/HSCLK  (via drill 0.3)
  Top 0.203: J3.17 21.6,30.46 13.51,22.38 11.05,22.38 9.7,21.03 v9.7,18.82
  Bottom 0.203: U2.19 9.58,18.82 v9.7,18.82
IO15/CS0  (via drill 0.3)
  Top 0.203: J3.16 22,30.25 13.69,21.95 11.23,21.95 10.24,20.95 v10.24,19.36
  Bottom 0.203: U2.21 10.18,19.36 v10.24,19.36
IO16/TP_RST  (via drill 0.3)
  Top 0.203: J3.7 21.2,37.48 v21.61,37.9 | v8.51,22.61 8.51,36.85 10.74,39.09 v19.61,39.09
  Bottom 0.203: U2.22 8.51,21.59 v8.51,22.61 | v21.61,37.9 21.61,38.7 C5.2 R9.1 19.62,39.1 v19.61,39.09
IO17
  Bottom 0.203: J1.1 5.99,26.06 9.07,22.99 9.07,21.6 U2.23
IO18
  Bottom 0.203: J1.2 6,28.27 7.06,28.27 7.37,27.96 7.37,25.35 9.5,23.22 9.5,21.73 U2.24
IO19  (via drill 0.3)
  Top 0.203: v11.23,20.42 13.99,20.42 19.74,26.16 25.02,26.16 27.43,28.57 v27.43,29.87
  Bottom 0.203: R2.1 v27.43,29.87 | U2.25 11.23,20.57 v11.23,20.42
IO20  (via drill 0.3)
  Top 0.203: v26.82,28.83 24.61,26.62 19.56,26.62 13.92,20.98 v11.81,20.98
  Bottom 0.203: v26.82,28.83 R21.1 | U2.26 11.38,20.98 v11.81,20.98
IO21/LCD_RS  (via drill 0.3)
  Top 0.203: v10.06,22.89 10.41,23.24 13.18,23.24 20.7,30.76 20.7,32.11 20.04,32.77 20.04,33.98 20.4,34.34 J3.20
  Bottom 0.203: U2.27 10.06,22.87 v10.06,22.89
IO38/TWI_SDA  (via drill 0.3)
  Top 0.203: J3.6 20.8,38.15 v20.93,38.28
  Bottom 0.203: v20.93,38.28 20.93,34.67 19.79,33.53 19.79,32.08 17.68,29.97 17.68,25.58 16.94,24.84 16.94,18.75 17.3,18.39 17.3,17.98 U2.43
IO39/TWI_SCK  (via drill 0.3)
  Top 0.203: J3.5 20.4,38.17 v20.27,38.3 | v17.53,17.32 17.53,18.36 v16.13,19.76
  Bottom 0.203: v20.27,38.3 20.27,34.77 19.3,33.81 19.3,32.23 17.23,30.16 17.23,25.84 16.51,25.12 16.51,20.14 v16.13,19.76 | U2.44 16.47,16.46 17.17,16.46 17.53,16.82 v17.53,17.32
IO40  (via drill 0.3)
  Top 0.203: J3.4 20,37.53 v19.63,37.9 | v18.09,18.09 18.09,18.64 16.08,20.65 v15.95,20.65
  Bottom 0.203: U2.45 16.34,16.03 17.42,16.03 18.09,16.69 v18.09,18.09 | v19.63,37.9 19.63,34.77 18.85,33.98 18.85,32.44 16.75,30.34 16.75,26.02 16.08,25.35 16.08,20.78 v15.95,20.65
IO41/MISO  (via drill 0.3)
  Top 0.305: v17.98,21.87 20.02,21.87 v21.74,20.14 21.74,18.72 19.51,16.48 v14.76,16.48
  Bottom 0.203: v14.76,16.48 U2.47
  Bottom 0.254: 21.74,20.82 R7.1 | D4.6 17.98,22.35 v17.98,21.87
  Bottom 0.305: v21.74,20.14 21.74,20.82
  Bottom 0.406: SD.7 22.07,21.17 R7.1
IO42/SCLK  (via drill 0.3)
  Top 0.254: v18.75,22.89 19.89,22.89 22.45,20.32 v22.45,18.97
  Top 0.305: v22.45,18.97 22.45,18.31 19.1,14.96 v16.46,14.96
  Bottom 0.203: U2.48 15.71,14.96 v16.46,14.96
  Bottom 0.254: D4.5 v18.75,22.89
  Bottom 0.406: SD.5 v22.45,18.97 R5.1
IO45  (via drill 0.3)
  Top 0.203: v16.36,39.7 9.37,39.7 7.06,37.39 7.06,17.58 10.29,14.35 12.7,14.35 v13.66,15.32
  Bottom 0.203: R28.2 R19.2 16.83,39.23 v16.36,39.7 | v13.66,15.32 13.66,15.31 U2.51
N$1  (via drill 0.3)
  Top 0.203: J3.18 21.2,33.47 v21.03,33.3
  Bottom 0.203: R10.2 D1.+ 21.03,32.7 v21.03,33.3
N$2
  Bottom 0.61: IC2.5 28.67,36.03 R1.1
N$6
  Bottom 0.254: USB.A5 31.5,32.11 30.3,30.91 R14.1
N$7
  Bottom 0.406: PWR.C 19.95,43.76 R16.2
N$14
  Bottom 0.254: USB.B5 30.94,29.11 29.62,27.79 R3.1
N$20
  Bottom 0.203: Q5.1 R20.2 R19.1
N$21  (via drill 0.3)
  Top 0.203: J3.23 19.2,33.88 v18.11,32.79
  Bottom 0.203: R17.1 17.55,32.23 v18.11,32.79
N$22
  Bottom 0.203: R17.2 R18.2 16.45,34.12 Q5.3
N$25
  Bottom 0.61: CHG.- R15.1
N$26
  Bottom 0.61: IC2.1 R15.2
N$30
  Bottom 0.508: ANT1.FEED C12.2 | C12.2 11.6,9.83 11.61,9.83 | 11.61,9.83 L4.1 | 11.61,9.83 C12.2 | C12.2 11.6,7.85 L2.2
N$31
  Bottom 0.203: U2.1 11.6,11.56 C13.2 | 11.6,10.96 11.61,10.95 11.6,10.94 L4.2 | 11.79,13.59 11.79,11.63 | 11.43,13.23 11.43,11.71
  Bottom 0.406: 11.43,11.71 11.43,11.56 11.6,11.56 11.79,11.56 11.79,11.63
  Bottom 0.762: C13.2 11.6,10.96
N$32
  Bottom 0.203: U2.35 15.6,21.36 15.6,26.2 R29.2
N$33  (1 unrouted)
  Bottom 0.203: 9.37,12.41 C19.2 9.38,12.33 U2.3 | L1.2 9.37,11.75 U2.2 U2.3 | U2.3 | 11.18,14.1 11.43,13.84 9.83,12.24 9.83,10.64 9.02,10.64 9.02,11.58 9.17,11.73 9.17,12.5 9.6,12.5 11.15,14.05 11.28,13.92
  Bottom 0.305: 11.28,13.92 9.6,12.24 9.6,11.28 9.2,11.28 9.2,11.56 9.32,11.68 9.32,12.09
N$34  (1 unrouted)
  Bottom 0.508: L2.1 10.21,7.85 9.75,8.31
N$35
  Bottom 0.203: U2.34 15.19,21.52 15.19,25.62 R30.2
N$37
  Bottom 0.203: U2.54 15.09,12.19 R26.2
N$38
  Bottom 0.203: U2.33 14.71,21.61 14.71,23.34 13.97,24.08 13.97,25.82 R31.2
N$40
  Bottom 0.203: U2.31 13.82,21.85 13.82,22.63 12.72,23.72 R32.2
N$41
  Bottom 0.203: U2.30 13.39,21.98 13.39,22.4 11.68,24.11 R33.2
N$47
  Bottom 0.406: SD.1 R13.1
N$48
  Bottom 0.406: SD.8 21.76,22.27 R8.1
N$63  (1 unrouted)
  Bottom 0.203: U2.49 15.8,14.3 16.66,14.3 17.45,13.51
N$65
  Bottom 0.203: U2.53 14.07,13.77 16.15,13.77 16.69,13.23 | 16.69,13.23 17.84,12.08 X1.3 | C9.2 16.69,13.22 16.69,13.23
N$66
  Bottom 0.203: R26.1 C4.1 15.77,10.07 X1.1
N$67  (via drill 0.3)
  Top 0.203: J3.24 18.8,34.32 v18.09,33.6
  Bottom 0.203: v18.09,33.6 17.61,33.6 R18.1
N$76
  Bottom 0.406: U5.4 C11.2
SPICLK
  Bottom 0.203: R31.1 13.77,27.08 12.95,27.89 U3.6
SPICS0  (via drill 0.3)
  Top 0.203: v10.41,34.47 13.39,34.47 13.74,34.11 13.74,25.65 v13.36,25.27
  Bottom 0.203: U2.32 14.25,21.72 14.25,22.89 13.36,23.77 v13.36,25.27 | U3.1 v10.41,34.47
SPID
  Bottom 0.203: R29.1 15.9,27.84 15.06,28.68 14.23,28.68 U3.5
SPIHD
  Bottom 0.203: R33.1 U3.7
SPIQ  (via drill 0.3)
  Top 0.203: v14.81,27.53 14.81,34.29 13.87,35.23 v11.71,35.23
  Bottom 0.203: R30.1 v14.81,27.53 | U3.2 11.68,35.26 v11.71,35.23
SPIWP  (via drill 0.3)
  Top 0.203: v12.42,27.48 12.95,28.02 v12.95,33.88
  Bottom 0.203: R32.1 12.72,27.18 v12.42,27.48 | U3.3 v12.95,33.88
U0RXD  (via drill 0.3)
  Top 0.203: v22.68,8.79 23.42,9.53 23.42,16.64 22.71,17.35 22.2,17.35 19.18,14.33 v14.91,14.33
  Bottom 0.203: U2.50 14.91,14.63 v14.91,14.33 | v22.68,8.79 RX.T
U0TXD
  Bottom 0.203: R27.1 18.82,13.3 18.82,11 19.51,10.31 TX.T
USB_D+
  Bottom 0.254: USB.A6 33.37,31.11 33.68,31.42 34.49,31.42 34.75,31.17 34.75,30.48 34.38,30.11 USB.B6 31.05,30.11 29.77,28.83 R21.2
USB_D-  (via drill 0.3)
  Top 0.254: v34.06,32.18 v34.06,30.76
  Bottom 0.254: v34.06,30.76 33.91,30.61 USB.A7 30.79,30.61 30.05,29.87 R2.2 | USB.B7 32.98,31.61 33.55,32.18 v34.06,32.18
VBAT  (via drill 0.3)
  Top 0.61: v32.21,39.7 v27.53,39.7 26.31,39.7 v24.41,37.8
  Bottom 0.61: IC2.3 32.21,38.41 | 32.21,38.41 C8.2 | BAT.1 v27.52,39.71 v27.53,39.7 | Q3.3 24.41,37.27 v24.41,37.8 24.41,38.34 R12.2 | 32.21,38.41 v32.21,39.7
VDD_SPI
  Bottom 0.203: U2.29 10.41,24.21 C35.2 C37.2 U3.8
VSYS
  Bottom 0.406: U5.1 22.52,30.73 | 22.52,30.73 22.52,31.82 C42.2 22.55,33.45 D3.- 22.47,34.18 Q3.2 | U5.3 24.42,30.42 24.16,30.68 22.57,30.68 22.52,30.73
  pour Bottom: 21.95,28.8 21.95,34.8 22.66,35.51 23.83,35.51 23.83,34.52 23.11,33.81 23.11,31.37 23.44,31.04 24.54,31.04 25.02,30.56 25.02,28.85 24.13,28.85 24.13,30.2 23.93,30.4 23.04,30.4 22.89,30.25 22.89,28.8

### Text on the board
tPlace: 24 | 13 | 1 | 12 | ESP32-S3 Round | SPI TFT with Touch | 1.28" GC9A01 v1.1 | www.makerfabs.com
bPlace: - | + | GND | +3V3 | IO17 | IO18 | GND | +3V3 | IO38 | IO39
225bmp: X1